# Altium schematic sheet UC03_Lagrange.SchDoc: Lagrange USB-UART Bridge
size A4; Paper_Prj_Name: [PL-AAA-00]; Date: 1; CheckedBy: 1; Author: 1; CompanyName: PAPER LLC; DrawnBy: Raum; Engineer: 1; Organization: PAPER LLC; Revision: V 1.0; SheetNumber: 1; SheetTotal: 1; UCL-PRJ-CODE: [UC03]; Init_Drawn_Date: Jul 06, 2027; CurrentTime: 1; CurrentDate: 1; Time: 1; DocumentFullPathAndName: 1; DocumentName: 1; ProjectName: 1
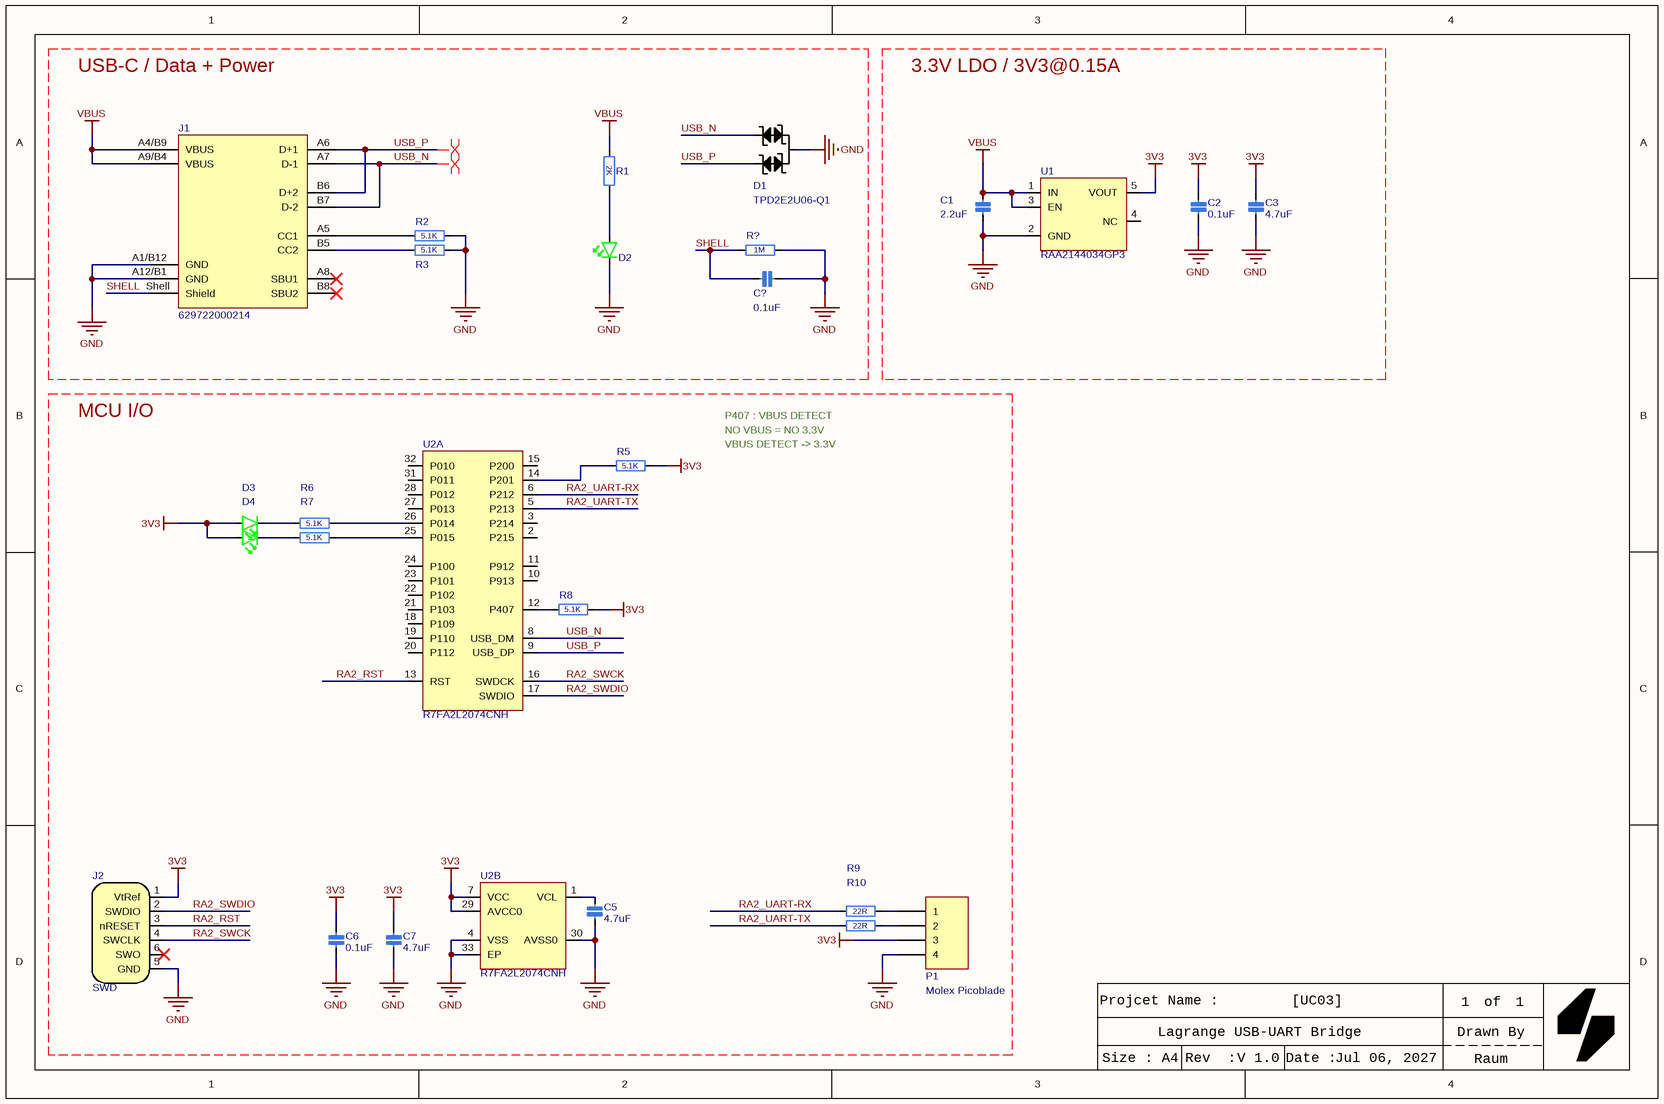
[diagram p0: UC03_Lagrange.SchDoc]

## Parts
C1  2.2uF  [CAPC1608X90N_2]
C2  0.1uF  [CAPC1608X90N_2]
C3  4.7uF  [CAPC1608X90N_2]
C5  4.7uF  [CAPC1608X90N_2]
C6  0.1uF  [CAPC1608X90N_2]
C7  4.7uF  [CAPC1608X90N_2]
C?  0.1uF  [CAPC1608X90N_2]
D1  TPD2E2U06-Q1  [SC70_3]
D2  GRN  [LED-0603-GREEN]  (value not drawn)
D3  GRN  [LED-0603-GREEN]  (value not drawn)
D4  GRN  [LED-0603-GREEN]  (value not drawn)
J1  629722000214  [629722000214]
J2  SWD  [TC2030-MCP]  (no BOM)
P1  Molex Picoblade  [2053380004]
R1  2K  [RESC1608X55N_2]  (value not drawn)
R2  5.1K  [RESC1608X55N_2]  (value not drawn)
R3  5.1K  [RESC1608X55N_2]  (value not drawn)
R5  5.1K  [RESC1608X55N_2]  (value not drawn)
R6  5.1K  [RESC1608X55N_2]  (value not drawn)
R7  5.1K  [RESC1608X55N_2]  (value not drawn)
R8  5.1K  [RESC1608X55N_2]  (value not drawn)
R9  22R  [RESC1608X55N_2]  (value not drawn)
R10  22R  [RESC1608X55N_2]  (value not drawn)
R?  1M  [RESC1608X55N_2]  (value not drawn)
U1  RAA2144034GP3  [SOT23-5]
U2  R7FA2L2074CNH  [ALLEGRO QFN-32 ET]  (parts A,B of 2)

## Nets
3V3: C2.1 C3.1 C6.1 C7.1 D3.A D4.A J2.1(VtRef) P1.3 R5.2 R8.2 U1.5(VOUT) U2.7(VCC) U2.29(AVCC0)
GND: C1.2 C2.2 C3.2 C5.2 C6.2 C7.2 C?.1 D1.3(CC) D2.K J1.A1/B12(GND) J1.A12/B1(GND) J2.5(GND) P1.4 R2.2 R3.2 R?.1 U1.2(GND) U2.4(VSS) U2.30(AVSS0) U2.33(EP)
VBUS: C1.1 J1.A4/B9(VBUS) J1.A9/B4(VBUS) R1.2 U1.1(IN) U1.3(EN)
RA2_RST: J2.3(nRESET) U2.13(RST)
RA2_SWCK: J2.4(SWCLK) U2.16(SWDCK)
RA2_SWDIO: J2.2(SWDIO) U2.17(SWDIO)
RA2_UART-RX: R9.1 U2.6(P212)
RA2_UART-TX: R10.1 U2.5(P213)
SHELL: C?.2 J1.Shell(Shield) R?.2
USB_N: D1.2(IO2) J1.A7(D-1) J1.B7(D-2) U2.8(USB_DM)
USB_P: D1.1(IO2) J1.A6(D+1) J1.B6(D+2) U2.9(USB_DP)
NetC5_1: C5.1 U2.1(VCL)
NetD2_A: D2.A R1.1
NetD3_K: D3.K R6.1
NetD4_K: D4.K R7.1
NetJ1_A5: J1.A5(CC1) R2.1
NetJ1_B5: J1.B5(CC2) R3.1
NetP1_1: P1.1 R9.2
NetP1_2: P1.2 R10.2
NetR5_1: R5.1 U2.14(P201)
NetR6_2: R6.2 U2.26(P014)
NetR7_2: R7.2 U2.25(P015)
NetR8_1: R8.1 U2.12(P407)

Not connected (* = marked no-connect by the designer): J1 A8(SBU1)* B8(SBU2)*; J2 6(SWO)*; U1 4(NC); U2 2(P215) 3(P214) 10(P913) 11(P912) 15(P200) 18(P109) 19(P110) 20(P112) 21(P103) 22(P102) 23(P101) 24(P100) 27(P013) 28(P012) 31(P011) 32(P010)

## Layout directives
differential pair: USB_N, USB_P

## Notes on the sheet
- USB-C / Data + Power
- 3.3V LDO / 3V3@0.15A
- MCU I/O
- P407 : VBUS DETECT
- NO VBUS = NO 3.3V
- VBUS DETECT -> 3.3V
- Size : A4
- Projcet Name :
- Rev  :
- Date :
- Drawn By
- of

## Library data of the parts
C1-C3 C5-C7 C? = CAP_MLCC: Ceramic MLCC CAP; Manufacture: Murata; Volage Rating: 50V; Dielectric: X5R
  C1: Value: 2.2uF
  C2 C6 C?: Value: 0.1uF
  C3 C5 C7: Value: 4.7uF
D1 = TPD2E2U06-Q1: Automotive Dual-Channel High-Speed ESD Protection Device; Full Part Number: SP712-02HTG
D2-D4 = LED_GREEN: CHIP LED GREEN; Part Number: LG L29K Smartled Green; Manufacturer: Multicomp; Manufacturer Part Number: LG L29K-G2J1-24-Z; Value: L0603G; Note: 2,24..5.6 mcd, Vfmin=1.7V; Artikkelnr Noca: N.A.; Datasheet: http://www.osram-os.com/Graphics/XPic2/00077107_0.pdf; Footprint Doc: 0603; LatestRevisionDate: 2014-10-28; Pin Count: 2; Publisher: Nordic Semiconductor; Published: 2014-10-28; Supplier: Digi-Key; Supplier part number: 475-2709-1-ND; 2nd source Supplier: *; 2nd source part number: *; Artikkelnr Simpro: N.A.
J1 = 629722000214: WR-COM USB 2.0 Type C Receptacle Horizontal SMT; Manufacturer: Wurth Elektronik; Match Code: WR-USB; Interface Type: Type C; Number of Ports: 1; Rated Current: 5A; Working Voltage: 20V (DC); Manufacturer Part Number: 629722000214; Category: Input/Output Connectors; ComponentLink1Description: Website Link; ComponentLink1URL: https://www.we-online.com/redexpert/article/629722000214?ad; ComponentLink2Description: Datasheet Link; ComponentLink2URL: https://www.we-online.com/redexpert/spec/629722000214?ad; Mount: Surface Mount; Min Operating Temperature: -40°C; Max Operating Temperature: 85°C; Packaging: Tape and Reel; Application: USB 2.0; Gender: Receptacle; Number of Pins: 16; Orientation: Horizontal
J2 = TC2030-MCP-NL: Conector par ICD
P1 = Header 4: Header, 4-Pin; LatestRevisionDate: 17-Jul-2002; LatestRevisionNote: Re-released for DXP Platform.; Publisher: Altium Limited
R1-R3 R5-R10 R? = R_Film_Chip: Chip FIlm Resistor; Manufacture: Vishay; Full Part Number: CRCW0603
  R1: Value: 2K
  R2 R3 R5-R8: Value: 5.1K
  R9 R10: Value: 22R
  R?: Value: 1M
U1 = RAA2144034GP3: Low Iq Current LDO Regulator with Fixed 3.3V Output
U2 = R7FA2L2074CNH: Ultra low power 48 MHz Arm® Cortex®-M23 core, up to 128-KB code flash memory, 16-KB SRAM, USB 2.0 Full-Speed / module (USBFS), USB Type-C® interface (USBCC), 12-bit A/D Converter, Security and Safety features